# EAGLE design TeensyChopper (EAGLE 6.4)
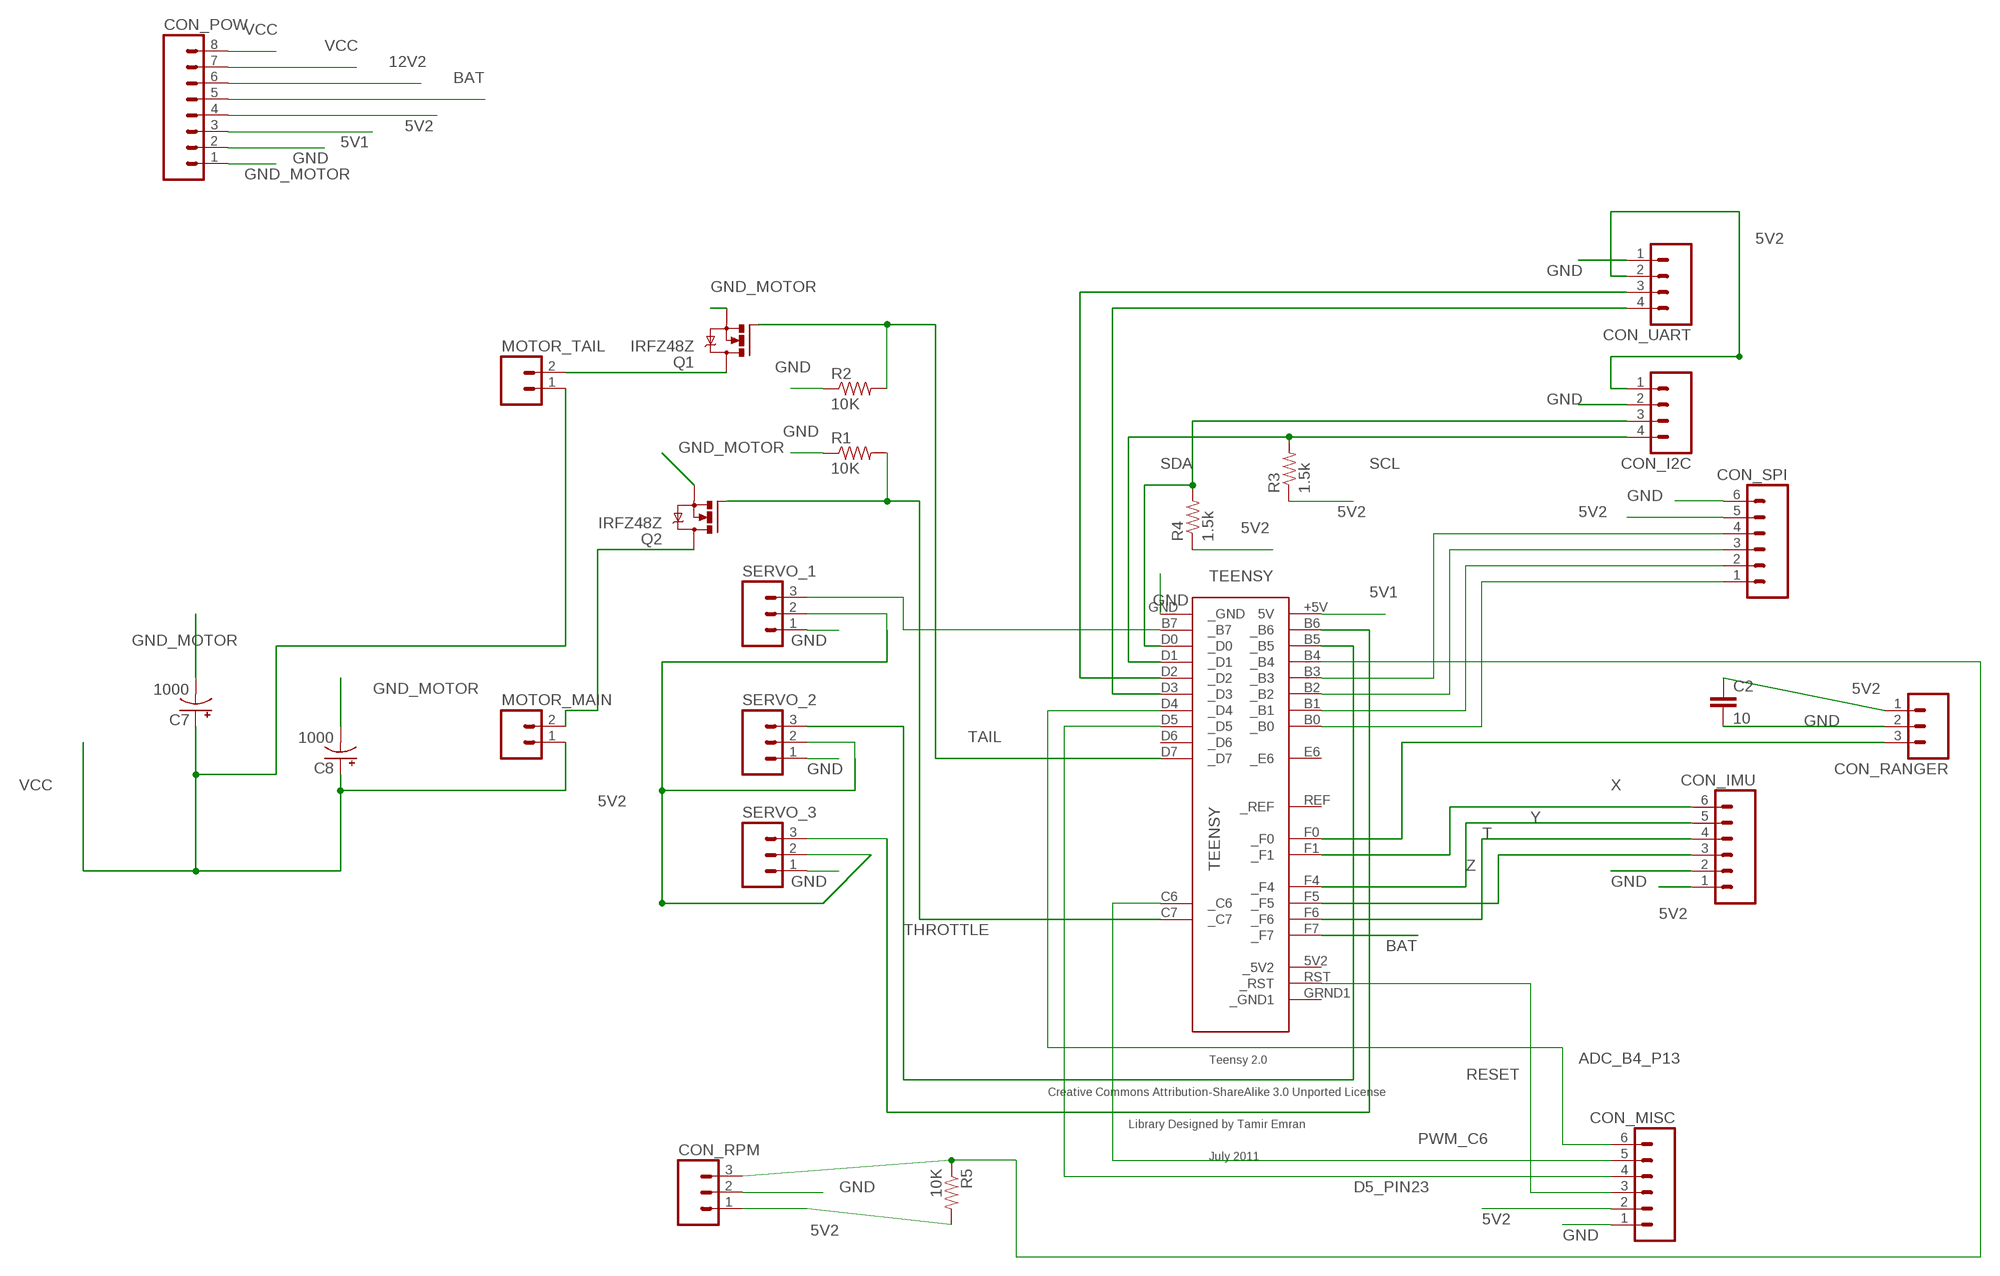
[diagram p0: schematic, sheet 1]

## Parts
C2  10  CAPKIT  [CAP-PTH-SMALL-KIT]
C7  1000  CAP_POLPTH4  [CPOL-RADIAL-1000UF-25V]
C8  1000  CAP_POLPTH4  [CPOL-RADIAL-1000UF-25V]
CON_I2C  M04PTH  [1X04]
CON_IMU  M06LOCK  [1X06_LOCK]
CON_MISC  M06LOCK  [1X06_LOCK]
CON_POW  M081X08  [1X08]
CON_RANGER  M03PTH  [1X03]
CON_RPM  M03PTH  [1X03]
CON_SPI  M06LOCK  [1X06_LOCK]
CON_UART  M04PTH  [1X04]
MOTOR_MAIN  M025MM  [SCREWTERMINAL-5MM-2]
MOTOR_TAIL  M025MM  [SCREWTERMINAL-5MM-2]
Q1  IRFZ48Z  [TO220BH]
Q2  IRFZ48Z  [TO220BH]
R1  10K  RESISTORPTH-1/4W  [AXIAL-0.4]
R2  10K  RESISTORPTH-1/4W  [AXIAL-0.4]
R3  1.5k  RESISTORPTH-1/4W  [AXIAL-0.4]
R4  1.5k  RESISTORPTH-1/4W  [AXIAL-0.4]
R5  10K  RESISTORPTH-1/4W  [AXIAL-0.4]
SERVO_1  M03PTH  [1X03]
SERVO_2  M03PTH  [1X03]
SERVO_3  M03PTH  [1X03]
TEENSY  TEENSY  [TEENSY]

## Nets
5V1: CON_POW.3 TEENSY.+5V(5V)
5V2: C2.1 CON_I2C.1 CON_IMU.1 CON_MISC.2 CON_POW.4 CON_RANGER.1 CON_RPM.1 CON_SPI.5 CON_UART.2 R3.P$1 R4.P$1 R5.P$2 SERVO_1.2 SERVO_2.2 SERVO_3.2
12V2: CON_POW.6
ADC_B4_P13: CON_MISC.6 TEENSY.D4(_D4)
BAT: CON_POW.5 TEENSY.F7(_F7)
D5_PIN23: CON_MISC.4 TEENSY.D5(_D5)
GND: C2.2 CON_I2C.2 CON_IMU.2 CON_MISC.1 CON_POW.2 CON_RANGER.2 CON_RPM.2 CON_SPI.6 CON_UART.1 R1.P$1 R2.P$1 SERVO_1.1 SERVO_2.1 SERVO_3.1 TEENSY.GND(_GND)
GND_MOTOR [motor]: C7.2(-) C8.2(-) CON_POW.1 Q1.S Q2.S
N$1: CON_RANGER.3 TEENSY.F0(_F0)
N$2: SERVO_1.3 TEENSY.B7(_B7)
N$3: CON_SPI.1 TEENSY.B0(_B0)
N$4: CON_SPI.2 TEENSY.B1(_B1)
N$5: CON_RPM.3 R5.P$1 TEENSY.B4(_B4)
N$6: CON_SPI.3 TEENSY.B2(_B2)
N$7 [motor]: MOTOR_MAIN.2 Q2.D
N$8 [motor]: MOTOR_TAIL.2 Q1.D
N$9: SERVO_3.3 TEENSY.B6(_B6)
N$10: CON_SPI.4 TEENSY.B3(_B3)
N$11: SERVO_2.3 TEENSY.B5(_B5)
PWM_C6: CON_MISC.5 TEENSY.C6(_C6)
RESET: CON_MISC.3 TEENSY.RST(_RST)
RX: CON_UART.3 TEENSY.D2(_D2)
SCL: CON_I2C.4 R3.P$2 TEENSY.D1(_D1)
SDA: CON_I2C.3 R4.P$2 TEENSY.D0(_D0)
T: CON_IMU.4 TEENSY.F6(_F6)
TAIL: Q1.G R2.P$2 TEENSY.D7(_D7)
THROTTLE: Q2.G R1.P$2 TEENSY.C7(_C7)
TX: CON_UART.4 TEENSY.D3(_D3)
VCC [motor]: C7.1(+) C8.1(+) CON_POW.7 CON_POW.8 MOTOR_MAIN.1 MOTOR_TAIL.1
X: CON_IMU.6 TEENSY.F1(_F1)
Y: CON_IMU.5 TEENSY.F4(_F4)
Z: CON_IMU.3 TEENSY.F5(_F5)
Unconnected: TEENSY.5V2(_5V2) TEENSY.D6(_D6) TEENSY.E6(_E6) TEENSY.GRND1(_GND1) TEENSY.REF(_REF)

## Library data of the parts
C2 = SparkFun:CAP: Capacitor Standard 0603 ceramic capacitor, and 0.1" leaded capacitor.
C7 C8 = SparkFun-Capacitors:CAP_POL: Capacitor Polarized These are standard SMD and PTH capacitors. Normally 10uF, 47uF, and 100uF in electrolytic and tantalum varieties. Always verify the external diameter of the through hole cap, it varies with capacity, voltage, and manufacturer. The EIA devices should be standard.
CON_I2C CON_UART = SparkFun:M04: Header 4 Standard 4-pin 0.1" header. Use with straight break away headers (SKU : PRT-00116), right angle break away headers (PRT-00553), swiss pins (PRT-00743), machine pins (PRT-00117), and female headers (PRT-00115). Molex polarized connector foot print use with SKU : PRT-08231 with associated crimp pins and housings. 1MM SMD Version SKU: PRT-10208
CON_IMU CON_MISC CON_SPI = SparkFun:M06: Header 6 Standard 6-pin 0.1" header. Use with straight break away headers (SKU : PRT-00116), right angle break away headers (PRT-00553), swiss pins (PRT-00743), machine pins (PRT-00117), and female headers (PRT-00115). Molex polarized connector foot print use with SKU : PRT-08094 with associated crimp pins and housings. NOTES ON THE VARIANTS LOCK and LOCK_LONGPADS... This footprint was designed to help hold the alignment of a through-hole component (i.e. 6-pin header) while soldering it into place. You may notice that each hole has been shifted either up or down by 0.005 of an inch from it's more standard position (which is a perfectly straight line). This slight alteration caused the pins (the squares in the middle) to touch the edges of the holes. Because they are alternating, it causes a "brace" to hold the component in place. 0.005 has proven to be the perfect amount of "off-center" position when using our standard breakaway headers. Although looks a little odd when you look at the bare footprint, once you have a header in there, the alteration is very hard to notice. Also, if you push a header all the way into place, it is covered up entirely on the bottom side. This idea of altering the position of holes to aid alignment will be further integrated into the Sparkfun Library for other footprints. It can help hold any component with 3 or more connection pins.
CON_POW = SparkFun:M08: Header 8 Standard 8-pin 0.1" header. Use with straight break away headers (SKU : PRT-00116), right angle break away headers (PRT-00553), swiss pins (PRT-00743), machine pins (PRT-00117), and female headers (PRT-00115).
CON_RANGER CON_RPM SERVO_1-SERVO_3 = SparkFun:M03: Header 3 Standard 3-pin 0.1" header. Use with straight break away headers (SKU : PRT-00116), right angle break away headers (PRT-00553), swiss pins (PRT-00743), machine pins (PRT-00117), and female headers (PRT-00115). Molex polarized connector foot print use with SKU : PRT-08232 with associated crimp pins and housings.
MOTOR_MAIN MOTOR_TAIL = SparkFun:M02: Header 2 Standard 2-pin 0.1" header. Use with straight break away headers (SKU : PRT-00116), right angle break away headers (PRT-00553), swiss pins (PRT-00743), machine pins (PRT-00117), and female headers (PRT-00115). Molex polarized connector foot print use with SKU : PRT-08233 with associated crimp pins and housings.
Q1 Q2 = transistor-power:IRFZ48: N Channel HEXFET® Power MOSFET Logic Level Source: http://www.irf.com/product-info/datasheets/data/irfz48z.pdf
R1 R2 R5 = SparkFun-Resistors:RESISTOR: Resistor Basic schematic elements and footprints for 0603, 1206, and PTH resistors.
R3 R4 = SparkFun:RESISTOR: Resistor Basic schematic elements and footprints for 0603, 1206, and PTH resistors.
TEENSY = teensy:TEENSY: Teensy 2.0 Original Design by Clint Fisher Modified Design by Tamir Emran Licensed Under Creative Commons Attribution-ShareAlike 3.0 Unported (CC BY-SA 3.0)

## Net classes
0 default: width 0.254 mm, drill 0.254 mm, clearance 0.254 mm
1 motor: width 1.27 mm, drill 0.254 mm, clearance 0.254 mm

## Board
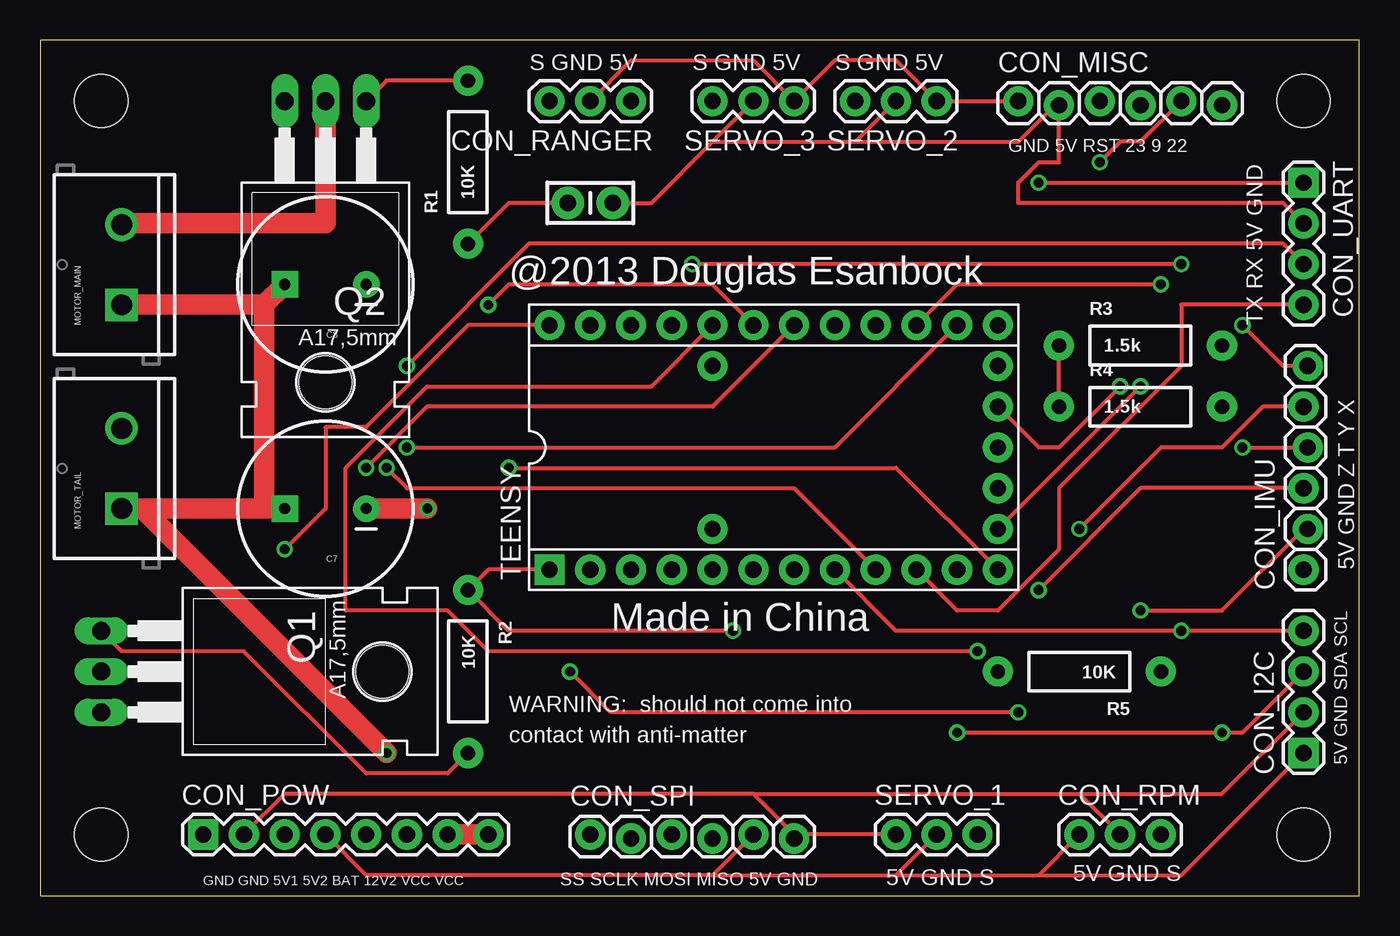
[diagram p1: board, top side]
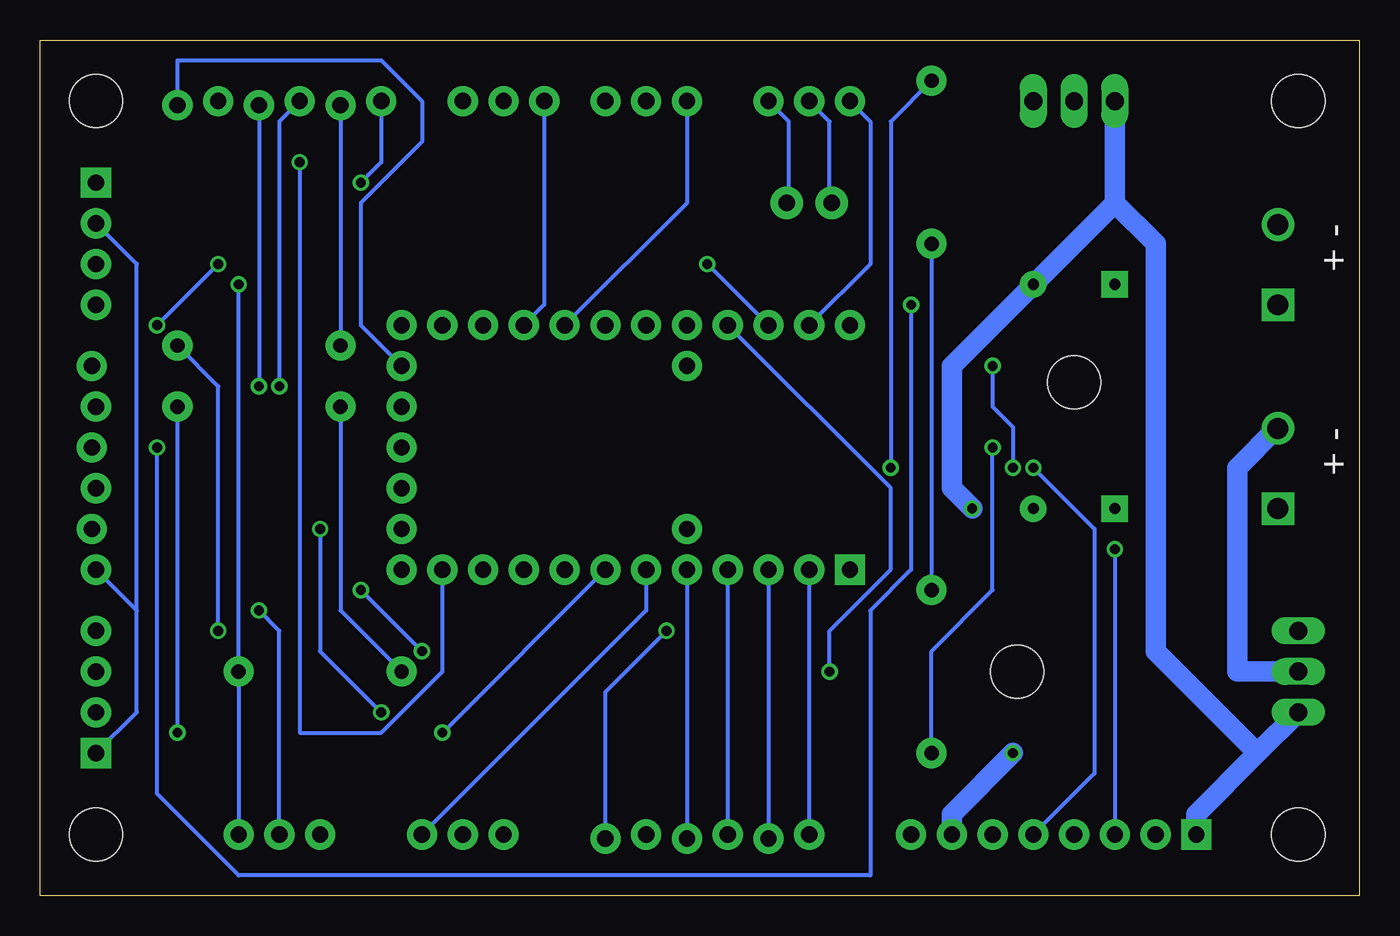
[diagram p2: board, bottom side, seen from below]

Size 82.22 x 53.33 mm. Coordinates in mm from the lower left corner, seen from the top.
Outline: 0,0 82.22,0 82.22,53.33 0,53.33 0,0
Copper layers (1*16): Top 0.035mm / dielectric 1.5mm / Bottom 0.035mm
Design rules "default": minimum track width 10mil, minimum drill 24mil, track to track 8mil, track to pad 8mil, pad to pad 8mil, via to via 8mil, smd to smd 8mil, copper to edge 40mil, drill to drill 8mil, minimum pad ring 10mil, minimum via ring 8mil, stop-mask expansion 4mil, vias tented up to drill 0mil, thermal gap 10mil

### Footprints (pad centres in the part's own frame; a part is rotated, then mirrored left to right if it is on the bottom)
CAP-PTH-SMALL-KIT = drill 1.016 pad 2.032: 1 -1.397,0; 2 1.397,0
CPOL-RADIAL-1000UF-25V = drill 0.7 pad 1.651 square: 1 2.54,0 | drill 0.7 pad 1.651: 2 -2.54,0
1X04 = drill 1.016 pad 1.88 square: 1 0,0 | drill 1.016 pad 1.88: 2 2.54,0; 3 5.08,0; 4 7.62,0
1X06_LOCK = drill 1.016 pad 1.88: 1 0,0; 2 2.54,-0.254; 3 5.08,0; 4 7.62,-0.254; 5 10.16,0; 6 12.7,-0.254
1X08 = drill 1.016 pad 1.88 square: 1 0,0 | drill 1.016 pad 1.88: 2 2.54,0; 3 5.08,0; 4 7.62,0; 5 10.16,0; 6 12.7,0; 7 15.24,0; 8 17.78,0
1X03 = drill 1.016 pad 1.88: 1 0,0; 2 2.54,0; 3 5.08,0
SCREWTERMINAL-5MM-2 = drill 1.3 pad 2.032 square: 1 0,0 | drill 1.3 pad 2.032: 2 5,0
TO220BH = drill 1.118 long: D 0,-6.35; G -2.54,-6.35; S 2.54,-6.35 | hole 3.302: 0,11.176
AXIAL-0.4 = drill 0.9 pad 1.88: P$1 -5.08,0; P$2 5.08,0
TEENSY = drill 1.016 pad 1.88: 5V2 13.97,-2.54; +5V -13.97,7.62; B0 -11.43,-7.62; B1 -8.89,-7.62; B2 -6.35,-7.62; B3 -3.81,-7.62; B4 8.89,7.62; B5 6.35,7.62; B6 3.81,7.62; B7 -1.27,-7.62; C6 11.43,-7.62; C7 13.97,-7.62; D0 1.27,-7.62; D1 3.81,-7.62; D2 6.35,-7.62; D3 8.89,-7.62; D4 13.97,5.08; D5 13.97,-5.08; D6 13.97,7.62; D7 11.43,7.62; E6 -3.81,-5.08; F0 -11.43,7.62; F1 -8.89,7.62; F4 -6.35,7.62; F5 -3.81,7.62; F6 -1.27,7.62; F7 1.27,7.62; GRND1 13.97,0; REF -3.81,5.08; RST 13.97,2.54 | drill 1.016 pad 1.88 square: GND -13.97,-7.62
STAND-OFF = hole 3.302: 0,0

### Placement (x,y rotation side)
C2  34.29,43.18 180 top
C7  17.78,24.13 180 top
C8  17.78,38.1 180 top
CON_I2C  78.74,8.89 90 top
CON_IMU  78.74,20.32 90 top
CON_MISC  60.96,49.53 0 top
CON_POW  10.16,3.81 0 top
CON_RANGER  36.83,49.53 180 top
CON_RPM  64.77,3.81 0 top
CON_SPI  34.29,3.81 0 top
CON_UART  78.74,44.45 270 top
MOTOR_MAIN  5.08,36.83 90 top
MOTOR_TAIL  5.08,24.13 90 top
Q1  10.16,13.97 270 top
Q2  17.78,43.18 180 top
R1  26.67,45.72 90 top
R2  26.67,13.97 270 top
R3  68.58,34.29 0 top
R4  68.58,30.48 0 top
R5  64.77,13.97 180 top
SERVO_1  53.34,3.81 0 top
SERVO_2  55.88,49.53 180 top
SERVO_3  46.99,49.53 180 top
TEENSY  45.72,27.94 0 top
U$1  [STAND-OFF]  3.81,49.53 0 top
U$2  [STAND-OFF]  78.74,49.53 0 top
U$3  [STAND-OFF]  78.74,3.81 0 top
U$4  [STAND-OFF]  3.81,3.81 0 top

### Tracks (layer width: path | path; a pad name or v marks a point on that pad's centre or on a via)
5V1  (via drill 0.61)
  Top 0.254: v15.24,21.59 17.78,24.13 17.78,29.21 20.32,29.21 26.67,35.56 TEENSY.+5V
  Bottom 0.254: v15.24,21.59 CON_POW.3
5V2
  Top 0.254: R4.P$1 R3.P$1 | 41.91,46.99 38.1,43.18 C2.1 35.56,43.18 | 41.91,46.99 SERVO_3.2 | 50.8,46.99 SERVO_2.2 | 41.91,46.99 50.8,46.99 | 50.8,46.99 60.96,46.99 63.5,49.53 CON_MISC.2 63.5,45.72 62.23,45.72 60.96,44.45 60.96,43.18 77.47,43.18 CON_UART.2 | CON_POW.4 20.32,1.27 41.91,1.27 | CON_SPI.5 41.91,1.27 | 53.34,1.27 SERVO_1.2 | 41.91,1.27 53.34,1.27 | 62.23,1.27 CON_RPM.1 | 53.34,1.27 62.23,1.27 | CON_I2C.1 71.12,1.27 62.23,1.27
  Bottom 0.254: R5.P$2 63.5,17.78 R4.P$1 | CON_RANGER.1 35.56,48.26 35.56,43.18 C2.1 | R3.P$1 CON_MISC.2 63.5,49.53 | 76.2,17.78 CON_IMU.1 | 76.2,17.78 76.2,11.43 CON_I2C.1 | CON_UART.2 76.2,39.37 76.2,17.78
ADC_B4_P13
  Bottom 0.254: TEENSY.D4 62.23,35.56 62.23,43.18 58.42,46.99 58.42,49.53 60.96,52.07 73.66,52.07 CON_MISC.6
BAT  (via drill 0.61)
  Top 0.254: v20.32,26.67 24.13,30.48 41.91,30.48 TEENSY.F7
  Bottom 0.254: CON_POW.5 16.51,7.62 16.51,22.86 v20.32,26.67
D5_PIN23  (via drill 0.61)
  Top 0.254: v68.58,31.75 TEENSY.D5
  Bottom 0.254: v68.58,31.75 CON_MISC.4 68.58,49.53
GND  (via drill 0.61)
  Top 0.254: CON_MISC.1 SERVO_2.1 53.34,52.07 49.53,52.07 SERVO_3.1 44.45,52.07 36.83,52.07 CON_RANGER.2 | v62.23,44.45 CON_UART.1 | TEENSY.GND 27.94,20.32 R2.P$1 29.21,16.51 v43.18,16.51 | R1.P$1 29.21,43.18 C2.2 33.02,43.18 | SERVO_1.1 46.99,3.81 | CON_POW.2 15.24,6.35 44.45,6.35 | 46.99,3.81 44.45,6.35 | 46.99,3.81 CON_SPI.6 | 64.77,6.35 CON_RPM.2 | 44.45,6.35 64.77,6.35 | CON_I2C.2 73.66,6.35 64.77,6.35 | v68.58,17.78 73.66,17.78 78.74,22.86 CON_IMU.2
  Bottom 0.254: v62.23,44.45 60.96,45.72 CON_MISC.1 | CON_RANGER.2 33.02,48.26 33.02,43.18 C2.2 | R1.P$1 R2.P$1 | v68.58,17.78 67.31,16.51 CON_RPM.2 | v43.18,16.51 46.99,12.7 CON_SPI.6
GND_MOTOR  (via drill 0.61)
  Top 1.27: v24.13,24.13 C7.2
  Bottom 1.27: 6.35,8.89 10.16,5.08 CON_POW.1 | 6.35,8.89 Q1.S | v24.13,24.13 25.4,25.4 25.4,33.02 C8.2 15.24,43.18 | 15.24,43.18 Q2.S | 6.35,8.89 12.7,15.24 12.7,40.64 15.24,43.18
N$1
  Bottom 0.254: TEENSY.F0 30.48,39.37 30.48,48.26 CON_RANGER.3
N$2
  Bottom 0.254: SERVO_1.3 44.45,17.78 TEENSY.B7
N$3
  Bottom 0.254: TEENSY.B0 CON_SPI.1
N$4
  Bottom 0.254: TEENSY.B1 CON_SPI.2
N$5  (via drill 0.61)
  Top 0.254: TEENSY.B4 57.15,38.1 v69.85,38.1
  Bottom 0.254: CON_RPM.3 R5.P$1 v69.85,38.1
N$6
  Bottom 0.254: TEENSY.B2 CON_SPI.3
N$7
  Top 1.27: Q2.D 17.78,41.91 5.08,41.91 MOTOR_MAIN.2
N$8
  Bottom 1.27: Q1.D 7.62,13.97 7.62,26.67 5.08,29.21 MOTOR_TAIL.2
N$9
  Bottom 0.254: TEENSY.B6 41.91,43.18 SERVO_3.3
N$10
  Bottom 0.254: TEENSY.B3 CON_SPI.4
N$11
  Bottom 0.254: TEENSY.B5 50.8,36.83 SERVO_2.3
PWM_C6  (via drill 0.61)
  Top 0.254: v66.04,45.72 67.31,46.99 68.58,46.99 CON_MISC.5
  Bottom 0.254: TEENSY.C6 57.15,13.97 60.96,10.16 66.04,10.16 v66.04,45.72
RESET  (via drill 0.61)
  Top 0.254: TEENSY.RST 62.23,27.94 63.5,27.94 v67.31,31.75
  Bottom 0.254: v67.31,31.75 67.31,48.26 CON_MISC.3
RX  (via drill 0.61)
  Top 0.254: TEENSY.D2 46.99,25.4 22.86,25.4 v21.59,26.67 | v22.86,33.02 30.48,40.64 77.47,40.64 CON_UART.3
  Bottom 0.254: v21.59,26.67 21.59,29.21 22.86,30.48 v22.86,33.02
SCL  (via drill 0.61)
  Top 0.254: TEENSY.D1 53.34,16.51 v71.12,16.51 CON_I2C.4
  Bottom 0.254: R3.P$2 71.12,31.75 v71.12,16.51
SDA  (via drill 0.61)
  Top 0.254: v57.15,10.16 v73.66,10.16 74.93,10.16 CON_I2C.3
  Bottom 0.254: v57.15,10.16 TEENSY.D0 | v73.66,10.16 R4.P$2
T  (via drill 0.61)
  Top 0.254: v74.93,27.94 CON_IMU.4 | v27.94,36.83 29.21,38.1 41.91,38.1 TEENSY.F6
  Bottom 0.254: v74.93,27.94 74.93,6.35 69.85,1.27 30.48,1.27 30.48,17.78 27.94,20.32 v27.94,36.83
TAIL  (via drill 0.61)
  Top 0.254: Q1.G 5.08,15.24 12.7,15.24 20.32,7.62 25.4,7.62 R2.P$2 | TEENSY.D7 49.53,27.94 v22.86,27.94
  Bottom 0.254: v22.86,27.94 22.86,19.05 26.67,15.24 R2.P$2
THROTTLE  (via drill 0.61)
  Top 0.254: Q2.G 21.59,50.8 R1.P$2 | TEENSY.C7 53.34,26.67 v29.21,26.67
  Bottom 0.254: v29.21,26.67 29.21,48.26 R1.P$2
TX
  Top 0.254: TEENSY.D3 57.15,17.78 59.69,17.78 63.5,21.59 63.5,25.4 71.12,33.02 71.12,36.83 CON_UART.4
VCC  (via drill 0.61)
  Top 1.27: 13.97,36.83 C8.1 | MOTOR_MAIN.1 13.97,36.83 | CON_POW.8 CON_POW.7 | MOTOR_TAIL.1 6.35,24.13 | 6.35,24.13 13.97,24.13 | 13.97,24.13 C7.1 | 6.35,24.13 v21.59,8.89 | 13.97,24.13 13.97,36.83
  Bottom 1.27: CON_POW.7 25.4,5.08 v21.59,8.89
X  (via drill 0.61)
  Top 0.254: v71.12,39.37 v40.64,39.37 | v74.93,35.56 77.47,33.02 CON_IMU.6
  Bottom 0.254: v40.64,39.37 TEENSY.F1 | v74.93,35.56 v71.12,39.37
Y  (via drill 0.61)
  Top 0.254: v33.02,13.97 35.56,11.43 v60.96,11.43 | v64.77,22.86 69.85,27.94 73.66,27.94 76.2,30.48 CON_IMU.5
  Bottom 0.254: TEENSY.F4 29.21,25.4 29.21,20.32 33.02,16.51 v33.02,13.97 | v60.96,11.43 64.77,15.24 v64.77,22.86
Z  (via drill 0.61)
  Top 0.254: TEENSY.F5 38.1,31.75 24.13,31.75 19.05,26.67 19.05,17.78 25.4,17.78 27.94,15.24 v58.42,15.24 | v62.23,19.05 68.58,25.4 CON_IMU.3
  Bottom 0.254: v62.23,19.05 v58.42,15.24

### Text on the board
tNames: S GND 5V | S GND 5V | S GND 5V | GND 5V RST 23 9 22 | @2013 Douglas Esanbock | TX RX 5V GND | 5V GND Z T Y X | 5V GND SDA SCL | Made in China | WARNING: should not come into | contact with anti-matter | 5V GND S | GND GND 5V1 5V2 BAT 12V2 VCC VCC | SS SCLK MOSI MISO 5V GND | 5V GND S
bNames: + - | + -